# EAGLE design sx1509-breakout_mount_remap5 (EAGLE 9.1.3)
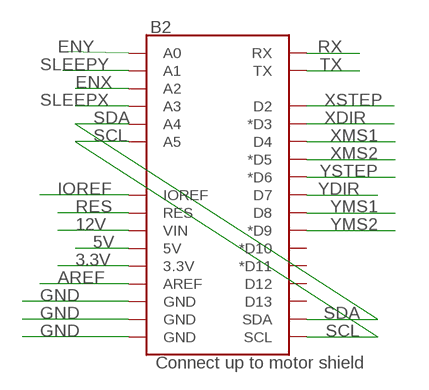
[diagram p0: schematic, sheet 1, part 1 of 2]
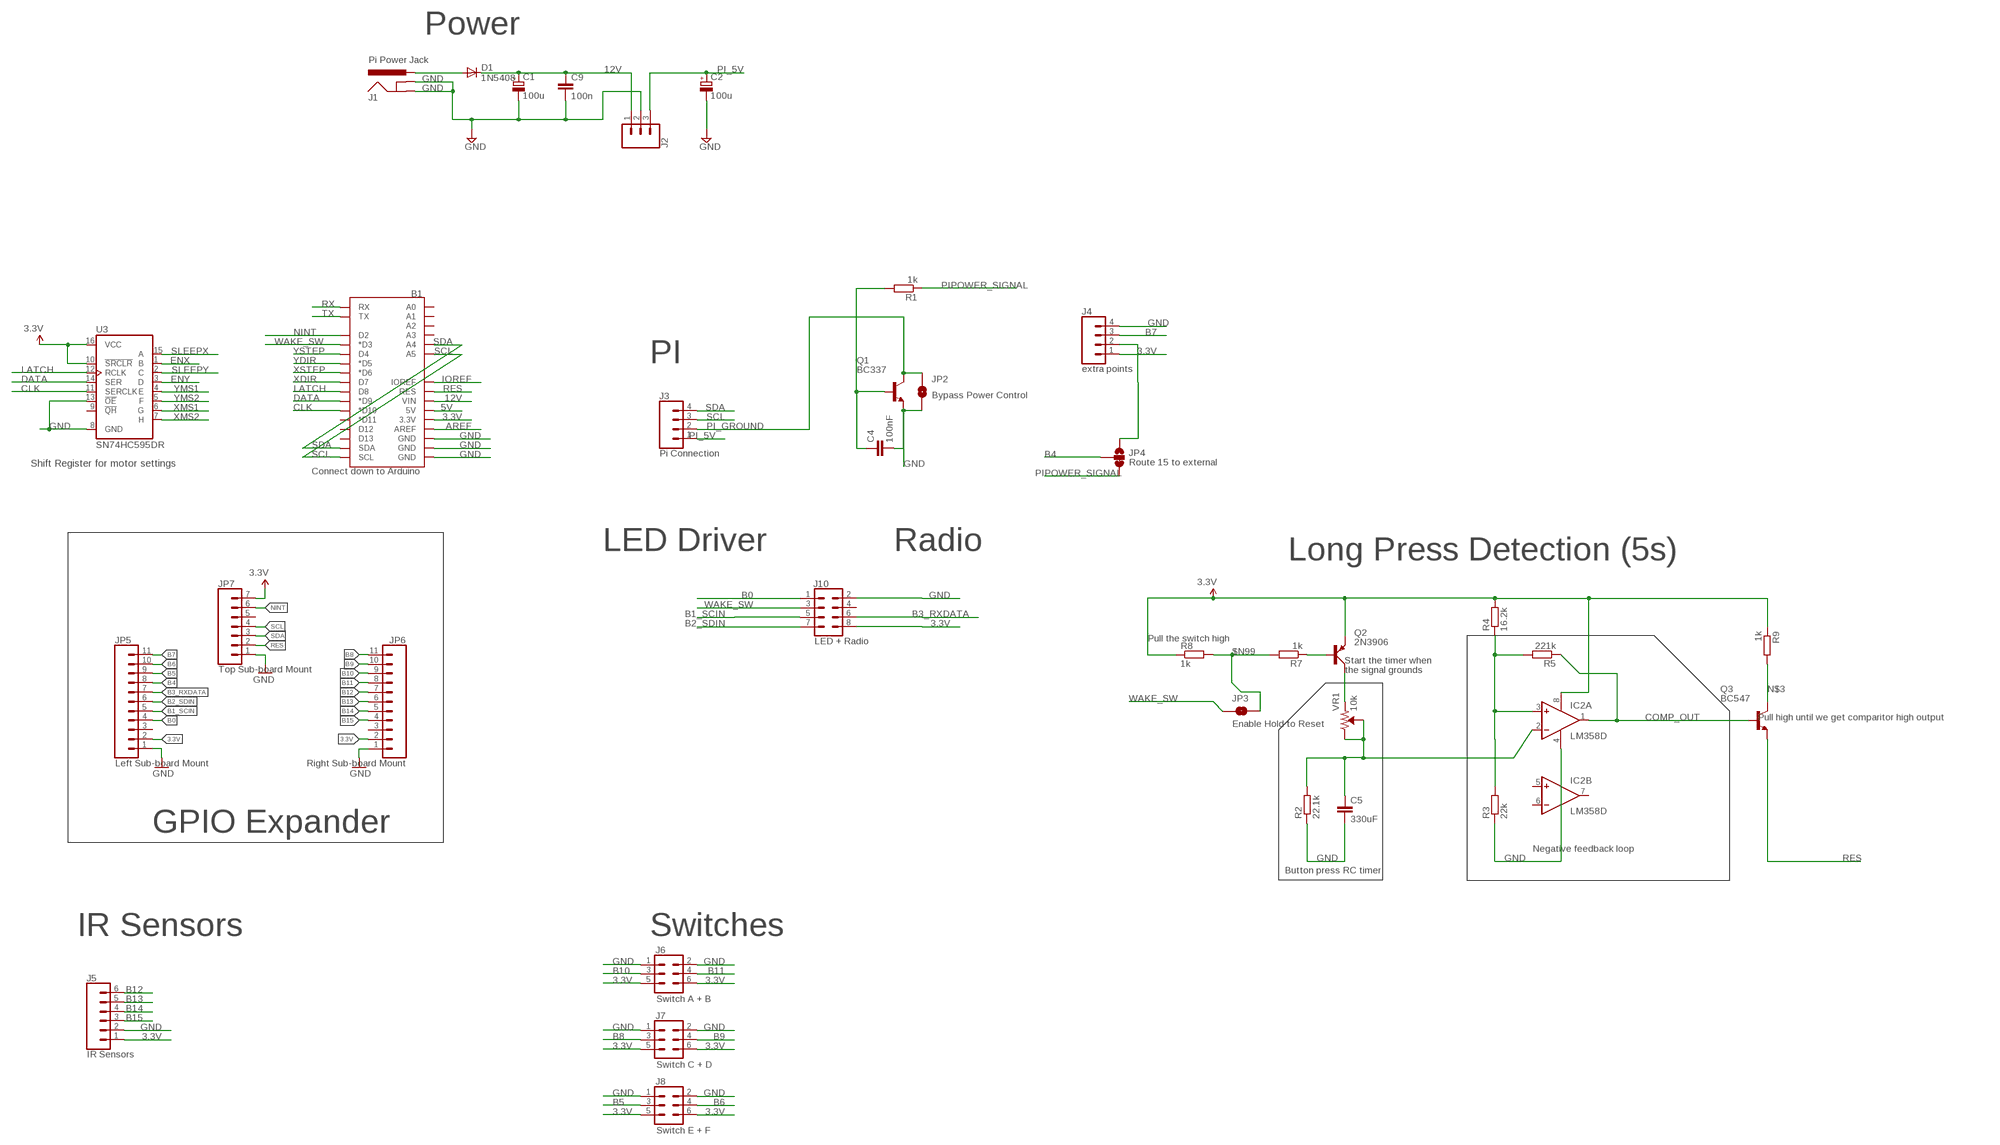
[diagram p1: schematic, sheet 1, part 2 of 2]

## Parts
B1  Connect down to Arduino  ARDUINO_UNO_R3_SHIELDNOLABELS  [UNO_R3_SHIELD_NOLABELS]
B2  Connect up to motor shield  ARDUINO_UNO_R3_SHIELDNOLABELS  [UNO_R3_SHIELD_NOLABELS]
C1  100u  CPOL-EUE2-5  [E2-5]
C2  100u  CPOL-EUE2-5  [E2-5]
C4  100nF  C-EUC0805  [C0805]
C5  330uF  C-EUC0805  [C0805]
C9  100n  C-EUC0805  [C0805]
D1  1N5408  [DO15-12]
IC2  LM358D  [SO08]
J1  Pi Power Jack  POWER_JACKPTH_BREAD  [POWER_JACK_PTH_BREAD]
J2  Header - Right angled, female  CONN_031X03_2.54MM_RA_FEMALE  [1X03]
J3  Pi Connection  CONN_041X04_1.24MM_RA_MALE  [1X04_1.24MM_RA_MALE]
J4  extra points  CONN_041X04_1.24MM_RA_MALE  [1X04_1.24MM_RA_MALE]
J5  IR Sensors  CONN_06SILK_FEMALE_PTH  [1X06]
J6  Switch A + B  CONN_03X22X03_2.54MM_RA_MALE  [2X3]
J7  Switch C + D  CONN_03X22X03_2.54MM_RA_MALE  [2X3]
J8  Switch E + F  CONN_03X22X03_2.54MM_RA_MALE  [2X3]
J10  LED + Radio  CONN_04X22X4_1.24MM_RA_MALE  [2X4]
JP2  Bypass Power Control  JUMPER-SMT_2_NO_SILK_ROUND  [SMT-JUMPER_2_NO_SILK_ROUND]
JP3  Enable Hold to Reset  JUMPER-SMT_2_NC_TRACE_SILK  [SMT-JUMPER_2_NC_TRACE_SILK]
JP4  Route 15 to external  JUMPER-SMT_3_1-NC_TRACE_SILK  [SMT-JUMPER_3_1-NC_TRACE_SILK]
JP5  Left Sub-board Mount  CONN_111X11_2.54MM_FEMALE  [1X11]
JP6  Right Sub-board Mount  CONN_111X11_2.54MM_FEMALE  [1X11]
JP7  Top Sub-board Mount  CONN_071X07_2.54MM_FEMALE  [1X07]
Q1  BC337  [TO92]
Q2  2N3906  [TO92D]
Q3  BC547  [TO92]
R1  1k  R-EU_M0805  [M0805]
R2  22.1k  R-EU_M0805  [M0805]
R3  22k  R-EU_M0805  [M0805]
R4  16.2k  R-EU_M0805  [M0805]
R5  221k  R-EU_M0805  [M0805]
R7  1k  R-EU_M0805  [M0805]
R8  1k  R-EU_M0805  [M0805]
R9  1k  R-EU_M0805  [M0805]
U3  SN74HC595DR  SN74HC595HCD  [SO16]
VR1  10k  TRIMPOT-PTH-10MM-KNOB-1/2W-10%  [TRIMPOT-PTH-3386U]

## Nets
3.3V: B1.3.3V B2.3.3V IC2.8(P:V+) J4.1 J5.1 J6.5 J6.6 J7.5 J7.6 J8.5 J8.6 J10.8 JP5.2 JP6.2 JP7.7 Q2.E R4.2 R8.1 R9.1 U3.10(!SRCLR) U3.16(VCC)
5V: B1.5V B2.5V
12V [12v]: B1.VIN B2.VIN C1.+ C9.1 D1.C J2.1
15_PLUG: J4.2 JP4.1
$N99: JP3.2 R7.2 R8.2
AREF: B1.AREF B2.AREF
B0: J10.1 JP5.4
B1_SCIN: J10.5 JP5.5
B2_SDIN: J10.7 JP5.6
B3_RXDATA: J10.6 JP5.7
B4: JP4.2 JP5.8
B5: J8.3 JP5.9
B6: J8.4 JP5.10
B7: J4.3 JP5.11
B8: J7.3 JP6.11
B9: J7.4 JP6.10
B10: J6.3 JP6.9
B11: J6.4 JP6.8
B12: J5.6 JP6.7
B13: J5.5 JP6.6
B14: J5.4 JP6.5
B15: J5.3 JP6.4
CLK: B1.D10(*D10) U3.11(SERCLK)
COMP_OUT: IC2.1(A:OUT) Q3.2(B) R5.1
DATA: B1.D9(*D9) U3.14(SER)
ENX: B2.A2 U3.1(B)
ENY: B2.A0 U3.3(D)
GND [5v]: B1.GND@0(GND) B1.GND@1(GND) B1.GND@2(GND) B2.GND@0(GND) B2.GND@1(GND) B2.GND@2(GND) C1.- C2.- C4.2 C5.2 C9.2 IC2.4(P:V-) J1.GND J1.GNDBREAK J2.2 J4.4 J5.2 J6.1 J6.2 J7.1 J7.2 J8.1 J8.2 J10.2 JP2.2 JP5.1 JP6.1 JP7.1 Q1.1(E) R2.1 R3.1 U3.8(GND) U3.13(!OE)
IOREF: B1.IOREF B2.IOREF
LATCH: B1.D8 U3.12(RCLK)
N$1: Q2.B R7.1
N$2: C4.1 Q1.2(B) R1.2
N$3: Q3.3(C) R9.2
N$4 [12v]: D1.A J1.PWR
N$5: IC2.3(A:+IN) R3.2 R4.1 R5.2
N$7: Q2.C VR1.1(CCW)
N$8: C5.1 IC2.2(A:-IN) R2.2 VR1.2(WIPER) VR1.3(CW)
NINT: B1.D2 JP7.6
PI_5V [5v]: C2.+ J2.3 J3.1
PI_GROUND [5v]: J3.2 JP2.1 Q1.3(C)
PIPOWER_SIGNAL: JP4.3 R1.1
RES: B1.RES B2.RES JP7.2 Q3.1(E)
RX: B1.RX B2.RX
SCL: B1.A5 B1.SCL B2.A5 B2.SCL J3.3 JP7.4
SDA: B1.A4 B1.SDA B2.A4 B2.SDA J3.4 JP7.3
SLEEPX: B2.A3 U3.15(A)
SLEEPY: B2.A1 U3.2(C)
TX: B1.TX B2.TX
WAKE_SW: B1.D3(*D3) J10.3 JP3.1
XDIR: B1.D7 B2.D3(*D3)
XMS1: B2.D4 U3.6(G)
XMS2: B2.D5(*D5) U3.7(H)
XSTEP: B1.D6(*D6) B2.D2
YDIR: B1.D5(*D5) B2.D7
YMS1: B2.D8 U3.4(E)
YMS2: B2.D9(*D9) U3.5(F)
YSTEP: B1.D4 B2.D6(*D6)
Unconnected: B1.A0 B1.A1 B1.A2 B1.A3 B1.D11(*D11) B1.D12 B1.D13 B2.D10(*D10) B2.D11(*D11) B2.D12 B2.D13 IC2.5(B:+IN) IC2.6(B:-IN) IC2.7(B:OUT) J10.4 JP5.3 JP6.3 JP7.5 U3.9(!QH)

## Notes on the sheet
- Power
- PI
- Shift Register for motor settings
- LED Driver | Radio | Long Press Detection (5s)
- Start the timer when
  the signal grounds
- GPIO Expander
- Negative feedback loop
- Button press RC timer
- IR Sensors | Switches

## Library data of the parts
B1 B2 = keir_library:ARDUINO_UNO_R3_SHIELD: Arduino R3 Shield Footprint Shield form compatible with the Arduino Uno R3. SparkFun Products: MG2639 Cellular Shield <https://www.sparkfun.com/products/13120> MIDI Shield <https://www.sparkfun.com/products/12898> R3 Stackable Headers Kit <https://www.sparkfun.com/products/11417>
C1 C2 = rcl:CPOL-EU: POLARIZED CAPACITOR, European symbol; SPICEPREFIX: C
C4 C5 = resistor:C-EU: CAPACITOR, European symbol
C9 = rcl:C-EU: CAPACITOR, European symbol; SPICEPREFIX: C
D1 = keir_library:1N5408: DIODE controlled avalanche rectifier
IC2 = keir_library:LM358: OP AMP also LM158; LM258; LM2904 Source: http://cache.national.com/ds/LM/LM158.pdf
J1 = SparkFun-Connectors:POWER_JACK: Power Jack Connector This is the standard 5.5mm barrel jack for power. The PTH is the most common, proven, reliable, footprint. The Slot footprint only works if the mill layer is transmitted to the PCB fab house so be warned. Here are the connectors we sell at SparkFun: DC Barrel Power Jack/Connector <https://www.sparkfun.com/products/119> (PRT-00119) DC Barrel Power Jack/Connector (SMD) <https://www.sparkfun.com/products/12748> (PRT-12748) DC Barrel Jack Adapter - Breadboard Compatible <https://www.sparkfun.com/products/10811> (PRT-10811) It is used on this SparkFun product (and many, many others): SparkFun RedBoard - Programmed with Arduino <https://www.sparkfun.com/products/12757> (DEV-12757) Also, if you need a mating power supply or connector, please check these out: Wall Adapter Power Supply - 9VDC 650mA <https://www.sparkfun.com/products/298> (TOL-00298) DC Barrel Jack Adapter - Male <https://www.sparkfun.com/products/10287> (PRT-10287); PROD_ID: PRT-10811
J2 = keir_library:CONN_03: Multi connection point. Often used as Generic Header-pin footprint for 0.1 inch spaced/style header connections On any of the 0.1 inch spaced packages, you can populate with these: Break Away Headers - Straight <https://www.sparkfun.com/products/116> (PRT-00116) Break Away Male Headers - Right Angle <https://www.sparkfun.com/products/553> (PRT-00553) Female Headers <https://www.sparkfun.com/products/115> (PRT-00115) Break Away Headers - Machine Pin <https://www.sparkfun.com/products/117> (PRT-00117) Break Away Female Headers - Swiss Machine Pin <https://www.sparkfun.com/products/743> (PRT-00743) Stackable Header - 3 Pin (Female, 0.1") <https://www.sparkfun.com/products/13875> (PRT-13875) For SCREWTERMINALS and SPRING TERMINALS visit here: Screw Terimnals on SparkFun.com <https://www.sparkfun.com/search/results?term=Screw+Terminals> (5mm/3.5mm/2.54mm spacing) This device is also useful as a general connection point to wire up your design to another part of your project. Our various solder wires solder well into these plated through hole pads. Hook-Up Wire - Assortment (Stranded, 22 AWG) <https://www.sparkfun.com/products/11375> (PRT-11375) Hook-Up Wire - Assortment (Solid Core, 22 AWG) <https://www.sparkfun.com/products/11367> (PRT-11367) View the entire wire category on our website here <https://www.sparkfun.com/categories/141> Special notes: Molex polarized connector foot print use with SKU : PRT-08232 with associated crimp pins and housings.
J3 J4 = keir_library:CONN_04: Multi connection point. Often used as Generic Header-pin footprint for 0.1 inch spaced/style header connections On any of the 0.1 inch spaced packages, you can populate with these: Break Away Headers - Straight <https://www.sparkfun.com/products/116> (PRT-00116) Break Away Male Headers - Right Angle <https://www.sparkfun.com/products/553> (PRT-00553) Female Headers <https://www.sparkfun.com/products/115> (PRT-00115) Break Away Headers - Machine Pin <https://www.sparkfun.com/products/117> (PRT-00117) Break Away Female Headers - Swiss Machine Pin <https://www.sparkfun.com/products/743> (PRT-00743) For SCREWTERMINALS and SPRING TERMINALS visit here: Screw Terimnals on SparkFun.com <https://www.sparkfun.com/search/results?term=Screw+Terminals> (5mm/3.5mm/2.54mm spacing) This device is also useful as a general connection point to wire up your design to another part of your project. Our various solder wires solder well into these plated through hole pads. Hook-Up Wire - Assortment (Stranded, 22 AWG) <https://www.sparkfun.com/products/11375> (PRT-11375) Hook-Up Wire - Assortment (Solid Core, 22 AWG) <https://www.sparkfun.com/products/11367> (PRT-11367) View the entire wire category on our website here <https://www.sparkfun.com/categories/141> Special notes: Molex polarized connector foot print use with SKU : PRT-08231 with associated crimp pins and housings. 1MM SMD Version SKU: PRT-10208
J5 = SparkFun-Connectors:CONN_06: Multi connection point. Often used as Generic Header-pin footprint for 0.1 inch spaced/style header connections On any of the 0.1 inch spaced packages, you can populate with these: Break Away Headers - Straight <https://www.sparkfun.com/products/116> (PRT-00116) Break Away Male Headers - Right Angle <https://www.sparkfun.com/products/553> (PRT-00553) Female Headers <https://www.sparkfun.com/products/115> (PRT-00115) Break Away Headers - Machine Pin <https://www.sparkfun.com/products/117> (PRT-00117) Break Away Female Headers - Swiss Machine Pin <https://www.sparkfun.com/products/743> (PRT-00743) Arduino Stackable Header - 6 Pin <https://www.sparkfun.com/products/9280> (PRT-09280) For SCREWTERMINALS and SPRING TERMINALS visit here: Screw Terimnals on SparkFun.com <https://www.sparkfun.com/search/results?term=Screw+Terminals> (5mm/3.5mm/2.54mm spacing) This device is also useful as a general connection point to wire up your design to another part of your project. Our various solder wires solder well into these plated through hole pads. Hook-Up Wire - Assortment (Stranded, 22 AWG) <https://www.sparkfun.com/products/11375> (PRT-11375) Hook-Up Wire - Assortment (Solid Core, 22 AWG) <https://www.sparkfun.com/products/11367> (PRT-11367) View the entire wire category on our website here <https://www.sparkfun.com/categories/141>; PROD_ID: CONN-08437
J6-J8 = keir_library:CONN_03X2: Multi connection point. Often used as Generic Header-pin footprint for 0.1 inch spaced/style header connections You can populate with any combo of single row headers, but if you'd like an exact match, check these: Header - 2x3 (Male, 0.1") <https://www.sparkfun.com/products/12807> (PRT-12807) Header - 2x3 (Female, 0.1") <https://www.sparkfun.com/products/13010> (PRT-13010) 2x3 Pin Shrouded Header <https://www.sparkfun.com/products/10877> (PRT-10877) On any of the 0.1 inch spaced packages, you can populate with these: Break Away Headers - Straight <https://www.sparkfun.com/products/116> (PRT-00116) Break Away Male Headers - Right Angle <https://www.sparkfun.com/products/553> (PRT-00553) Female Headers <https://www.sparkfun.com/products/115> (PRT-00115) Break Away Headers - Machine Pin <https://www.sparkfun.com/products/117> (PRT-00117) Break Away Female Headers - Swiss Machine Pin <https://www.sparkfun.com/products/743> (PRT-00743) Special note: the shrouded connector mates well with our 3x2 ribbon cables: Ribbon Crimp Connector - 6-pin (2x3, Female) <https://www.sparkfun.com/products/10651> (PRT-10651) Ribbon Cable - 6 wire (15ft) <https://www.sparkfun.com/products/10646> (PRT-10646)
J10 = keir_library:CONN_04X2: Multi connection point. Often used as Generic Header-pin footprint for 0.1 inch spaced/style header connections On any of the 0.1 inch spaced packages, you can populate with these: Break Away Headers - Straight <https://www.sparkfun.com/products/116> (PRT-00116) Break Away Male Headers - Right Angle <https://www.sparkfun.com/products/553> (PRT-00553) Female Headers <https://www.sparkfun.com/products/115> (PRT-00115) Break Away Headers - Machine Pin <https://www.sparkfun.com/products/117> (PRT-00117) Break Away Female Headers - Swiss Machine Pin <https://www.sparkfun.com/products/743> (PRT-00743)
JP2 = SparkFun-Jumpers:JUMPER-SMT_2_NO: Normally open jumper This jumper has two pads in close proximity to each other. Apply solder to close the connection. Round pads are easier to solder for beginners, but are a lot larger. SparkFun Product that uses the round pads: SparkFun EL Sequencer <https://www.sparkfun.com/products/12781>
JP3 = SparkFun-Jumpers:JUMPER-SMT_2_NC_TRACE: Normally closed trace jumper This jumper has a trace between two pads so it's normally closed (NC). Use a razor knife to open the connection. For best results follow the IPC guidelines for cutting traces: Cutout at least 0.063 mm (0.005 in). Remove all loose material to clean up the cut area. Seal the cut with an approved epoxy. Reapply solder to reclose the connection.
JP4 = SparkFun-Jumpers:JUMPER-SMT_3_1-NC_TRACE: Normally closed trace jumper (1 of 2 connections) This jumper has a trace between two pads so it's normally closed (NC). The other connection is normally open (NO). Use a razor knife to open the connection. For best results follow the IPC guidelines for cutting traces: Cutout at least 0.063 mm (0.005 in). Remove all loose material to clean up the cut area. Seal the cut with an approved epoxy. Reapply solder to reclose the connection, or to close the NO connection.
JP5 JP6 = keir_library:CONN_11: Multi connection point. Often used as Generic Header-pin footprint for 0.1 inch spaced/style header connections On any of the 0.1 inch spaced packages, you can populate with these: Break Away Headers - Straight <https://www.sparkfun.com/products/116> (PRT-00116) Break Away Male Headers - Right Angle <https://www.sparkfun.com/products/553> (PRT-00553) Female Headers <https://www.sparkfun.com/products/115> (PRT-00115) Break Away Headers - Machine Pin <https://www.sparkfun.com/products/117> (PRT-00117) Break Away Female Headers - Swiss Machine Pin <https://www.sparkfun.com/products/743> (PRT-00743) For SCREWTERMINALS and SPRING TERMINALS visit here: Screw Terimnals on SparkFun.com <https://www.sparkfun.com/search/results?term=Screw+Terminals> (5mm/3.5mm/2.54mm spacing) This device is also useful as a general connection point to wire up your design to another part of your project. Our various solder wires solder well into these plated through hole pads. Hook-Up Wire - Assortment (Stranded, 22 AWG) <https://www.sparkfun.com/products/11375> (PRT-11375) Hook-Up Wire - Assortment (Solid Core, 22 AWG) <https://www.sparkfun.com/products/11367> (PRT-11367) View the entire wire category on our website here <https://www.sparkfun.com/categories/141>
JP7 = keir_library:CONN_07: Multi connection point. Often used as Generic Header-pin footprint for 0.1 inch spaced/style header connections On any of the 0.1 inch spaced packages, you can populate with these: Break Away Headers - Straight <https://www.sparkfun.com/products/116> (PRT-00116) Break Away Male Headers - Right Angle <https://www.sparkfun.com/products/553> (PRT-00553) Female Headers <https://www.sparkfun.com/products/115> (PRT-00115) Break Away Headers - Machine Pin <https://www.sparkfun.com/products/117> (PRT-00117) Break Away Female Headers - Swiss Machine Pin <https://www.sparkfun.com/products/743> (PRT-00743) For SCREWTERMINALS and SPRING TERMINALS visit here: Screw Terimnals on SparkFun.com <https://www.sparkfun.com/search/results?term=Screw+Terminals> (5mm/3.5mm/2.54mm spacing) This device is also useful as a general connection point to wire up your design to another part of your project. Our various solder wires solder well into these plated through hole pads. Hook-Up Wire - Assortment (Stranded, 22 AWG) <https://www.sparkfun.com/products/11375> (PRT-11375) Hook-Up Wire - Assortment (Solid Core, 22 AWG) <https://www.sparkfun.com/products/11367> (PRT-11367) View the entire wire category on our website here <https://www.sparkfun.com/categories/141> Special notes: Molex polarized connector foot print use with SKU : PRT-08231 with associated crimp pins and housings. 1MM SMD Version SKU: PRT-10208 NOTES ON THE VARIANTS LOCK and LOCK_LONGPADS... This footprint was designed to help hold the alignment of a through-hole component (i.e. 6-pin header) while soldering it into place. You may notice that each hole has been shifted either up or down by 0.005 of an inch from it's more standard position (which is a perfectly straight line). This slight alteration caused the pins (the squares in the middle) to touch the edges of the holes. Because they are alternating, it causes a "brace" to hold the component in place. 0.005 has proven to be the perfect amount of "off-center" position when using our standard breakaway headers. Although looks a little odd when you look at the bare footprint, once you have a header in there, the alteration is very hard to notice. Also,if you push a header all the way into place, it is covered up entirely on the bottom side.
Q1 = transistor-npn:BC337*: NPN Transistor
Q2 = transistor-small-signal:2N3906: PNP TRANSISTOR
Q3 = transistor-npn:BC547*: NPN Transistor; NOTE: Pull high until we get comparitor high output
R1-R5 R7 R9 = rcl:R-EU_: RESISTOR, European symbol; SPICEPREFIX: R
R8 = rcl:R-EU_: RESISTOR, European symbol; NOTE: Pull the switch high; SPICEPREFIX: R
U3 = keir_library:SN74HC595: 8-Bit Shift Register (Serial to Parallel) Datasheet <http://www.ti.com/lit/ds/symlink/sn74hc595.pdf> SparkFun Products Shift-In parallel out - SN74HC595; PROD_ID: IC-11325; VALUE: SN74HC165DR
VR1 = SparkFun-Resistors:TRIMPOT: Trimming Potentiometer (Trimpot) Three-terminal potentiometers, with an adjustable wiper and two adjustable resistors. A pot can be used to create a configurable voltage divider, or as a variable resistor. "Trimpots" are a subset of potentiometers, usually intended for "set-and-forget" applications. They're often more delicate than standard potentiometers - rated for fewer turns. Variants PTH-KNOB - PTH Trimpot w/ finger-adjustable knob Trimpot 10K with Knob <https://www.sparkfun.com/products/9806> (COM-09806) Datasheet <http://www.sparkfun.com/datasheets/Components/General/TSR-3386.pdf> SMD-3MM-CLOSED-FRAME - SMD 3mm Square Closed-Frame Trimpot Used on e.g. EasyDriver - Stepper Motor Driver <https://www.sparkfun.com/products/12779> Datasheet <http://www.bitechnologies.com/pdfs/22.pdf> (22AR10KTR) SMD-5MM - SMD 5mm Square Closed-Frame Trimpot Used on e.g. IOIO-OTG - V2.2 <https://www.sparkfun.com/products/13613> Datasheet <http://www.vishay.com/docs/51008/ts53.pdf> (TS53YL502MR10) SMD-3MM-1/10W-25% - 3mm Square Open-Frame Trimpot Used on e.g. SparkFun Shapeoko <https://www.sparkfun.com/products/13899> Datasheet <http://www.bourns.com/docs/Product-Datasheets/TC33.pdf> (TC33X-2-103E); PROD_ID: RES-09730; SF_SKU: COM-09806

## Net classes
1 12v: width 1.6 mm, clearance 0.31 mm
2 5v: width 1.6 mm

## Board
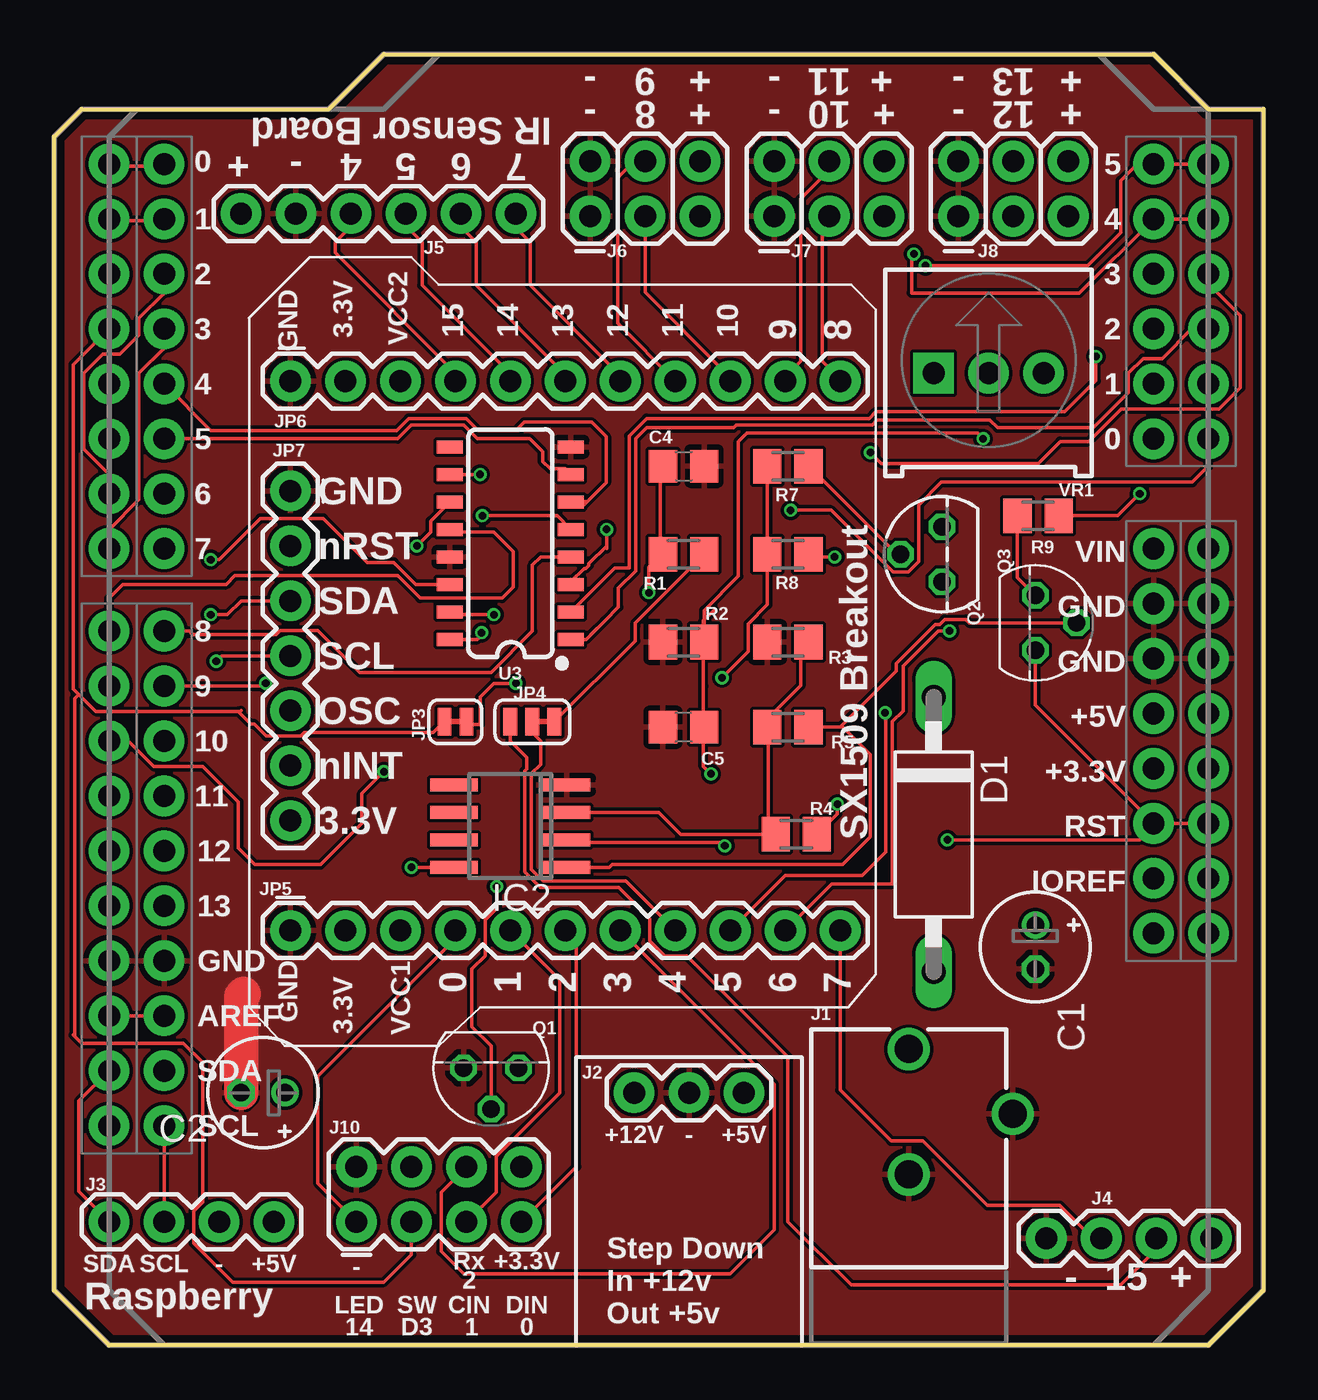
[diagram p2: board, top side]
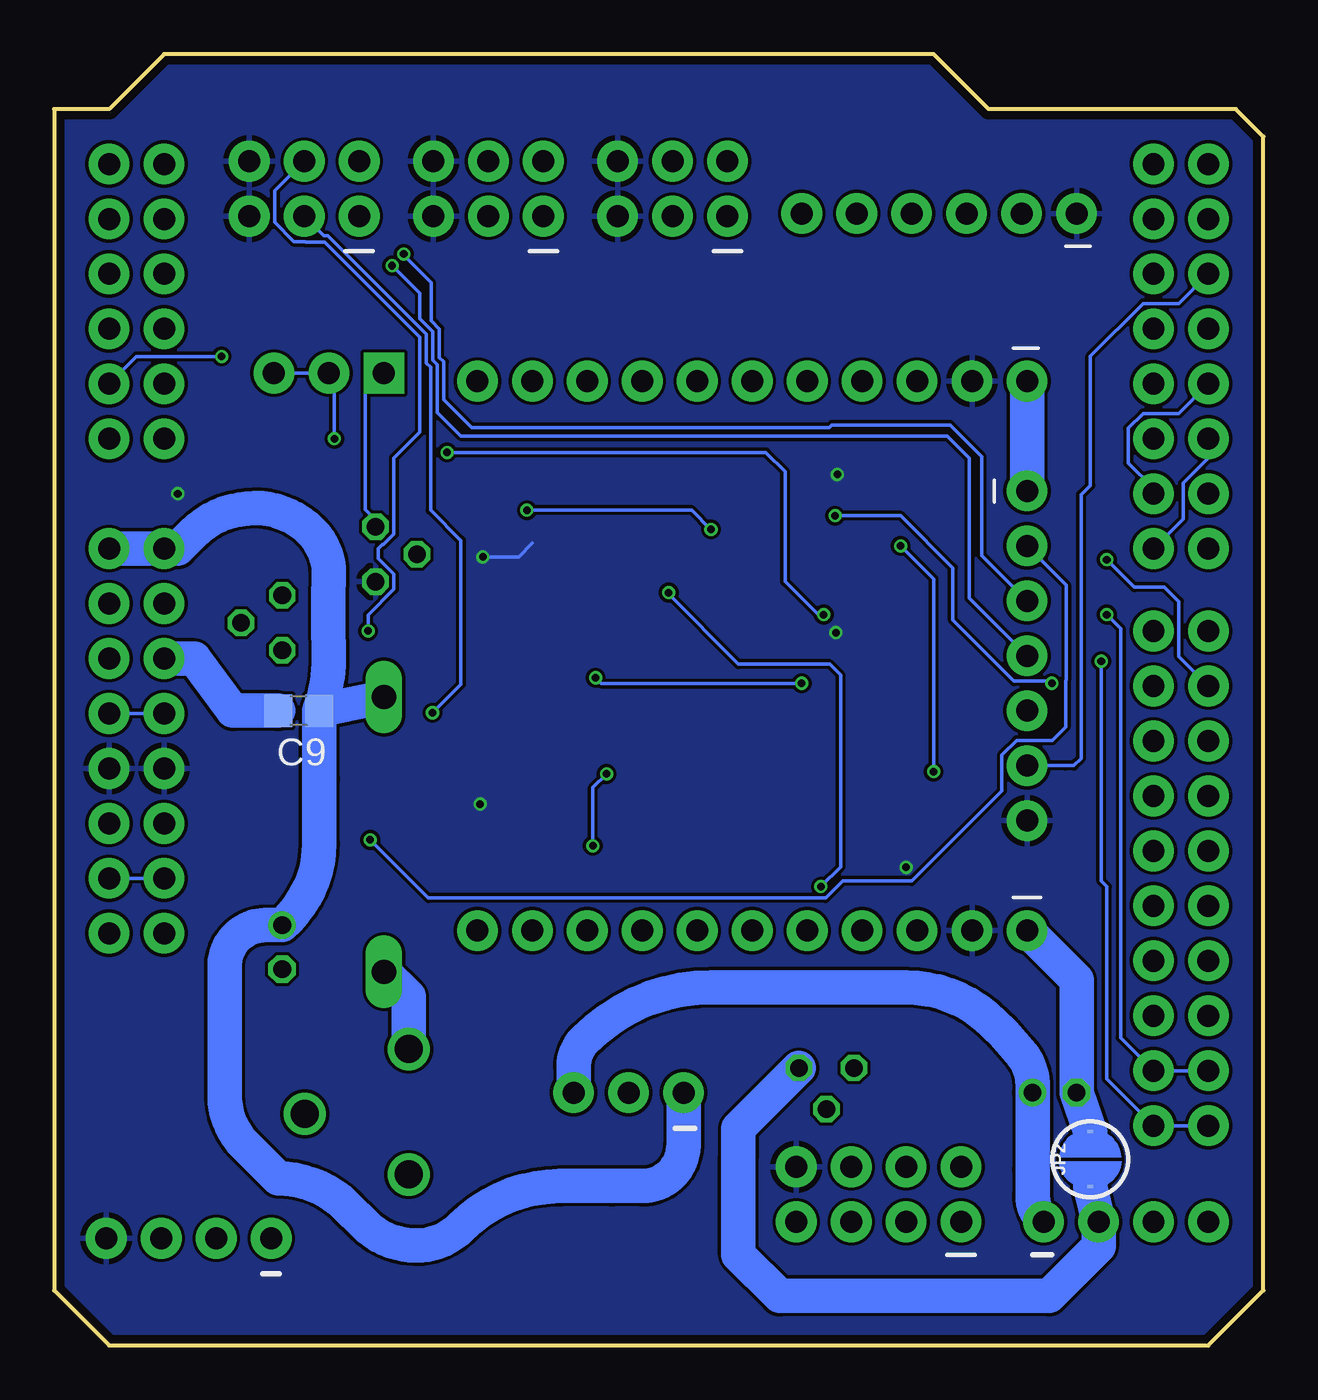
[diagram p3: board, bottom side, seen from below]

Size 55.88 x 59.69 mm. Coordinates in mm from the lower left corner, seen from the top.
Outline: 0,2.54 0,55.88 1.27,57.15 12.7,57.15 15.24,59.69 50.8,59.69 53.34,57.15 55.88,57.15 55.88,2.54 53.34,0 2.54,0 0,2.54
Copper layers (1*16): Top 0.035559375mm / dielectric 1.6mm / Bottom 0.035559375mm
Design rules "oshpark-2layer": minimum track width 6mil, minimum drill 10mil, track to track 6mil, track to pad 6mil, pad to pad 6mil, via to via 6mil, smd to smd 6mil, copper to edge 15mil, drill to drill 6mil, minimum pad ring 5mil, minimum via ring 5mil, stop-mask expansion 2.5mil, vias tented up to drill 0mil, thermal gap 10mil

### Footprints (pad centres in the part's own frame; a part is rotated, then mirrored left to right if it is on the bottom)
UNO_R3_SHIELD_NOLABELS = drill 1.016 pad 1.88: 3.3V 24.13,-3.81; 5V 24.13,-1.27; A0 24.13,11.43; A1 24.13,13.97; A2 24.13,16.51; A3 24.13,19.05; A4 24.13,21.59; A5 24.13,24.13; AREF -24.13,-15.24; D2 -24.13,19.05; D3 -24.13,16.51; D4 -24.13,13.97; D5 -24.13,11.43; D6 -24.13,8.89; D7 -24.13,6.35; D8 -24.13,2.54; D9 -24.13,0; D10 -24.13,-2.54; D11 -24.13,-5.08; D12 -24.13,-7.62; D13 -24.13,-10.16; GND@0 24.13,1.27; GND@1 24.13,3.81; GND@2 -24.13,-12.7; IOREF 24.13,-8.89; NC 24.13,-11.43; RES 24.13,-6.35; RX -24.13,24.13; SCL -24.13,-20.32; SDA -24.13,-17.78; TX -24.13,21.59; VIN 24.13,6.35
E2-5 = drill 0.813 pad 1.27: + -1.016,0 | drill 0.813 pad 1.27 octagon: - 1.016,0
C0805 = smd 1.3 x 1.5: 1 -0.95,0; 2 0.95,0
DO15-12 = drill 1.118 long: A 6.35,0; C -6.35,0
SO08 = smd 0.6 x 2.2: 1 -1.905,-2.6; 2 -0.635,-2.6; 3 0.635,-2.6; 4 1.905,-2.6; 5 1.905,2.6; 6 0.635,2.6; 7 -0.635,2.6; 8 -1.905,2.6
POWER_JACK_PTH_BREAD = drill 1.3: GND 0,7.9; GNDBREAK 4.8,10.7; PWR 0,13.7
1X03 = drill 1.016 pad 1.88: 1 0,0; 2 2.54,0; 3 5.08,0
1X04_1.24MM_RA_MALE = drill 1.016 pad 1.88: 1 0,0; 2 2.54,0; 3 5.08,0; 4 7.62,0
1X06 = drill 1.016 pad 1.88: 1 0,0; 2 2.54,0; 3 5.08,0; 4 7.62,0; 5 10.16,0; 6 12.7,0
2X3 = drill 1.016 pad 1.88: 1 0,0; 2 0,2.54; 3 2.54,0; 4 2.54,2.54; 5 5.08,0; 6 5.08,2.54
2X4 = drill 1.016 pad 1.88: 1 -3.81,-1.27; 2 -3.81,1.27; 3 -1.27,-1.27; 4 -1.27,1.27; 5 1.27,-1.27; 6 1.27,1.27; 7 3.81,-1.27; 8 3.81,1.27
SMT-JUMPER_2_NO_SILK_ROUND = smd 0.152 x 0.305: 1 -1.27,0; 2 1.27,0
SMT-JUMPER_2_NC_TRACE_SILK = smd 0.635 x 1.27: 1 -0.508,0; 2 0.508,0
SMT-JUMPER_3_1-NC_TRACE_SILK = smd 0.635 x 1.27: 1 -1.016,0; 2 0,0; 3 1.016,0
1X11 = drill 1.016 pad 1.88: 1 0,0; 2 2.54,0; 3 5.08,0; 4 7.62,0; 5 10.16,0; 6 12.7,0; 7 15.24,0; 8 17.78,0; 9 20.32,0; 10 22.86,0; 11 25.4,0
1X07 = drill 1.016 pad 1.88: 1 0,0; 2 2.54,0; 3 5.08,0; 4 7.62,0; 5 10.16,0; 6 12.7,0; 7 15.24,0
TO92 = drill 0.813 octagon: 1 1.27,0; 2 0,1.905; 3 -1.27,0
TO92D = drill 0.813 octagon: B 0,1.905; C 1.27,0; E -1.27,0
M0805 = smd 1.3 x 1.6: 1 -0.95,0; 2 0.95,0
SO16 = smd 0.6 x 1.2: 1 -4.445,-2.8; 2 -3.175,-2.8; 3 -1.905,-2.8; 4 -0.635,-2.8; 5 0.635,-2.8; 6 1.905,-2.8; 7 3.175,-2.8; 8 4.445,-2.8; 9 4.445,2.8; 10 3.175,2.8; 11 1.905,2.8; 12 0.635,2.8; 13 -0.635,2.8; 14 -1.905,2.8; 15 -3.175,2.8; 16 -4.445,2.8
TRIMPOT-PTH-3386U = drill 1.016 pad 1.88 square: 1 -2.54,-0.015 | drill 1.016 pad 1.88: 2 0,-0.015; 3 2.54,-0.015

### Placement (x,y rotation side)
B1  26.67,30.48 0 top
B2  29.21,30.48 0 top
C1  45.34,18.41 270 top
C2  9.65,11.68 180 top
C4  29.08,40.64 0 top
C5  29.08,28.57 180 top
C9  44.58,29.34 180 bottom
D1  40.64,23.62 270 top
IC2  21.08,24 90 top
J1  39.5,0 0 top
J2  26.8,11.68 0 top
J3  10.16,5.71 180 top
J4  53.47,4.95 180 top
J5  8.64,52.32 0 top
J6  24.77,52.2 0 top
J7  33.27,52.2 0 top
J8  41.78,52.2 0 top
J10  17.78,6.99 0 top
JP2  8,8.61 90 bottom
JP3  18.54,28.83 0 top
JP4  22.1,28.83 0 top
JP5  10.92,19.18 0 top
JP6  10.92,44.58 0 top
JP7  10.92,39.5 270 top
Q1  20.19,12.83 180 top
Q2  41.02,36.58 90 top
Q3  45.34,33.4 270 top
R1  29.08,36.58 180 top
R2  29.08,32.51 0 top
R3  33.91,32.51 0 top
R4  34.29,23.62 0 top
R5  33.91,28.57 180 top
R7  33.91,40.64 180 top
R8  33.91,36.58 180 top
R9  45.47,38.35 180 top
U3  21.08,37.08 90 top
U$2  [TRI_LOGO_TOP_15MM]  103.76,3.43 180 top  (outside the outline)
VR1  43.18,44.96 0 top

### Tracks (layer width: path | path; a pad name or v marks a point on that pad's centre or on a via)
3.3V  (via drill 0.35)
  Top 0.152: R8.1 34.99,36.45 v36.07,36.45 | IC2.8 v16.51,22.1 | R9.1 49.15,38.35 v50.16,39.37 | v36.2,25.02 36.2,24.58 R4.2 | U3.10 v19.68,40.26 | U3.16 19.56,32.64 19.75,32.84 v19.75,32.95
  Bottom 0.152: v36.07,36.45 34.42,36.45 33.78,37.08
  pour Bottom: 0,55.88 1.27,57.15 12.7,57.15 15.24,59.69 50.8,59.69 53.34,57.15 55.88,57.15 55.88,2.54 53.34,0 2.54,0 0,2.54
5V
  Bottom 0.152: B1.5V B2.5V
12V
  Bottom 1.6: B2.VIN B1.VIN 50.16,36.83 49.47,37.52 arc45 46.61,38.71 arc45 43.99,37.62 arc45 43.18,35.67 | 26.8,9.27 J2.1 26.8,9.27 | 26.8,9.27 arc90 28.7,7.37 30.1,7.37 32.51,7.37 arc-45 37.06,5.48 arc45 39.15,4.62 arc45 41.55,5.61 42.35,6.41 arc-45 45.53,7.72 47.03,9.23 arc45 48.01,11.58 48.01,17.53 arc90 46.1,19.43 C1.+ 45.07,19.7 arc-45 43.63,23.18 43.63,26.16 C9.1 | 43.18,35.67 | 43.18,35.67 arc-4 43.18,32 arc23 C9.1 | C9.1 D1.C
15_PLUG
  Top 0.152: 21,28.5 JP4.1 21.08,27.94 21.84,27.18 21.84,26.66 21.74,26.55 21.74,21.88 22.47,21.16 26.09,21.16 27.53,19.71 27.53,18.69 28.22,18.01 29.23,18.01 33.91,13.34 33.91,5.71 36.83,2.79 49.28,2.79 50.93,4.45 J4.2
$N99  (via drill 0.35)
  Top 0.152: R7.2 R8.2 32.96,34.23 32.08,33.36 32.08,32.08 v30.86,30.86 | JP3.2 19.18,28.7 19.68,28.7 19.68,29.97 20.32,30.61 v21.34,30.61
  Bottom 0.152: v21.34,30.61 30.61,30.61 v30.86,30.86
AREF
  Top 0.152: B2.AREF B1.AREF
B0
  Top 0.152: J10.1 12.19,7.49 12.19,10.41 12.19,12.45 18.54,18.8 JP5.4
B1_SCIN
  Top 0.152: J10.5 20.42,7.09 20.42,8.74 23.37,11.69 23.37,16.89 JP5.5
B2_SDIN
  Top 0.152: JP5.6 24.13,18.67 24.13,8.26 J10.7
B3_RXDATA
  Top 0.152: J10.6 17.88,7.09 17.88,4.34 18.92,3.3 31.24,3.3 33.27,5.33 33.27,12.06 JP5.7
B4
  Top 0.152: JP5.8 26.42,21.46 22.59,21.46 22.05,22.01 22.05,26.43 22.48,26.86 22.48,27.94 22.23,28.2 | 22.1,28.33 22.23,28.2 | JP4.2 22.1,28.33 | 22.1,28.33 22.23,28.2
B5  (via drill 0.35)
  Top 0.152: JP5.9 33.78,21.72 37.34,21.72 38.43,22.81 38.43,29.21 v38.4,29.25
  Bottom 0.152: J8.3 43.42,51.3 43.24,51.3 38.68,46.73 38.68,45.41 38.48,45.21 38.48,38.61 37.08,37.21 37.08,30.56 v38.4,29.25
B6  (via drill 0.35)
  Top 0.152: JP5.10 35.94,21.34 38.73,21.34 38.73,28.84 39.23,29.32 39.23,31.11 39.23,31.4 40.85,33.02 41.4,33.02 v41.38,33.02 v41.37,33.02
  Bottom 0.152: J8.4 45.7,53.37 45.7,51.92 44.81,51.03 44.3,51.03 44.26,50.99 43.37,50.99 38.99,46.61 38.99,42.22 40.18,41.02 40.18,37.59 40.18,37.5 40.67,37.01 40.72,37.01 40.89,36.83 40.89,36.36 40.18,35.65 40.18,35.43 40.18,34.96 41.37,33.77 v41.37,33.02
B7
  Top 0.152: JP5.11 36.32,11.81 38.68,9.45 40.14,9.45 43.12,6.47 46.48,6.47 47.99,4.95 J4.3
  Bottom 0.152: JP5.11 36.5,19
B8
  Top 0.152: JP6.11 36,45 35.5,45.5 35.5,52 J7.3
B9
  Top 0.152: JP6.10 34,45 34.5,45.5 34.5,53 35.5,54 35.5,54.5 J7.4
B10
  Top 0.152: JP6.9 31,45 27.3,48.7 J6.3
B11
  Top 0.152: JP6.8 26.04,47.24 26.04,53.98 26.8,54.74 J6.4
B12
  Top 0.152: JP6.7 26,45 22,49 22,51 21.5,51.5 21.5,52 J5.6
B13
  Top 0.152: JP6.6 23.5,45 19.5,49 19.5,51 19,51.5 19,52 J5.5
B14
  Top 0.152: JP6.5 21,45 17,49 17,51 16.5,51.5 16.5,52 J5.4
B15
  Top 0.152: JP6.4 18.5,45 13,50.5 13,51 13.5,51.5 13.5,52 J5.3
CLK  (via drill 0.35)
  Top 0.152: B1.D10 3.43,27.94 4.6,26.77 6.86,26.77 8.51,25.12 8.51,22.99 9.27,22.23 12.32,22.23 14.22,24.13 14.22,25.5 v15.24,26.52 | U3.11 17.4,38.11 17.4,37.97 17.4,37.59 v16.76,36.96
  Bottom 0.152: v15.24,26.52 15.24,30.48 15.24,35.43 v16.76,36.96 | v16.76,36.96 16.89,37.08 v16.76,36.96
COMP_OUT
  Top 0.152: 36.32,28.57 36.45,28.57 37.72,27.3 37.72,23.5 36.45,22.23 25.78,22.23 25.72,22.16 | 36.32,28.57 R5.1 | 36.32,28.57 38.92,31.17 38.92,31.52 40.72,33.33 40.92,33.33 41.15,33.55 42.12,33.55 42.28,33.4 Q3.2 | 25.65,22.1 25.72,22.16 | IC2.1 25.65,22.1 | 25.65,22.1 25.72,22.16
DATA  (via drill 0.35)
  Top 0.152: U3.14 16.71,35.18 15.7,36.19 14.48,36.19 12.45,38.23 9.53,38.23 7.62,36.32 v7.24,36.32
  Bottom 0.152: B1.D9 3.91,31.85 3.91,34.39 4.57,35.05 5.97,35.05 v7.24,36.32
ENX
  Top 0.152: B2.A2 52.58,46.99 51.21,45.62 50.32,45.62 49.63,44.93 49.63,44.04 48.01,42.42 43.6,42.42 43.24,42.77 38.02,42.77 37.79,42.54 31.52,42.54 31.4,42.42 27.38,42.42 26.87,41.91 26.87,35.8 26.07,35 26.07,34.12 25.44,33.49 | 24.8,32.85 25.44,33.49 | U3.1 24.59,32.64 25.44,33.49
ENY  (via drill 0.35)
  Top 0.152: v34.04,38.61 35.9,38.61 38.77,35.74 39.46,35.74 39.95,36.23 39.95,38.85 41,39.9 49.94,39.9 49.95,39.9 52.6,39.9 53.34,40.64 B2.A0 | 25.53,36.82 25.53,36.96 | 25.53,36.96 v25.53,37.72 | U3.3 23.88,35.31 24.49,35.92 24.58,35.92 24.71,36.05 24.71,36.14 25.53,36.96
  Bottom 0.152: v25.53,37.72 26.42,38.61 v34.04,38.61
GND
  Top 1.6: C2.- 8.64,16.13 8.76,16.26
  Bottom 1.6: JP2.2 C2.- 8.64,16.89 JP5.1 | B1.GND@0 49.4,31.75 47.62,29.34 C9.2 | JP7.1 JP6.1
  pour Top: 0,55.88 1.27,57.15 12.7,57.15 15.24,59.69 50.8,59.69 53.34,57.15 55.88,57.15 55.88,2.54 53.34,0 2.54,0 0,2.54
IOREF
  Bottom 0.152: B1.IOREF B2.IOREF
LATCH
  Top 0.152: U3.12 18.41,37.59 20.32,37.59 21.21,36.7 21.21,35.05 20.7,34.54 16.92,34.54 15.88,35.59 8.51,35.59 8.36,35.59 7.95,35.18 3.17,35.18 2.54,34.54 B1.D8
N$1
  Top 0.152: R7.1 35,40.5 39,36.5 Q2.B
N$2  (via drill 0.35)
  Top 0.152: C4.1 28,40.5 28,37 R1.2 28,36.5 27.48,35.98 v27.48,34.8 | Q1.2 20.19,13.84 19.3,14.73 19.3,17.4 19.91,18.01 19.91,19.66 20.45,20.19 v20.45,21.21
  Bottom 0.152: v20.45,21.21 19.54,22.12 19.54,30.99 20.04,31.5 24.26,31.5 27.56,34.8 v27.48,34.8
N$3
  Top 0.152: R9.2 44.5,38 44.5,35.51 Q3.3
N$4
  Bottom 1.6: J1.PWR 39.5,16.13 D1.A
N$5
  Top 0.152: R3.2 34.5,32.5 34.5,30.5 33,29 R5.2 33,28.5 33,24 R4.1 28.96,23.62 27.94,24.64 IC2.3
N$7
  Bottom 0.152: Q2.C 41.02,38.16 41.5,38.64 41.5,44.08 VR1.1
N$8  (via drill 0.35)
  Top 0.152: R2.2 30,32.5 30,30.48 30,29 C5.1 30,28.5 30,26.77 v30.35,26.42 | 30.5,34 30,33.5 30,33 R2.2 | R2.2 30.03,33.97 31.62,35.56 31.62,41.78 32,42.16 42.67,42.16 v42.93,41.91 | IC2.2 23.81,23.24 30.99,23.24 v30.99,23.09
  Bottom 0.152: v42.93,41.91 42.93,44.69 VR1.2 VR1.3 | v30.99,23.09 30.99,25.78 v30.35,26.42
NINT
  Bottom 0.152: JP7.6 9.14,26.8 8.76,26.8 8.42,27.14 8.42,39.33 8,39.75 8,45.72 5.56,48.16 3.91,48.16 B1.D2
PI_5V
  Bottom 1.6: J2.3 31.88,12.88 arc45 31.36,14.12 arc45 25.5,16.55 16.52,16.55 arc45 12.46,14.87 12,14.41 11.27,13.6 arc49 C2.+ 10.67,8.13 10.67,6.94 arc-45 J3.1
PI_GROUND
  Bottom 1.6: Q1.3 24.26,10.03 24.26,8.76 24.26,4.19 22.35,2.29 9.91,2.29 9.4,2.79 7.62,4.57 J3.2 JP2.1
PIPOWER_SIGNAL
  Top 0.152: R1.1 26.86,33.4 26.86,33.27 26.86,32.57 JP4.3
RES  (via drill 0.35)
  Top 0.152: Q3.1 45.34,29.59 B1.RES 50.93,24.13 | 50.93,24.13 B2.RES | v41.27,23.37 50.16,23.37 50.93,24.13
  Bottom 0.152: JP7.2 9.12,35.16 9.12,30.77 9.14,30.75 9.14,28.57 9.75,27.96 11.41,27.96 12.09,27.28 12.09,25.63 16.26,21.46 19.44,21.46 20.23,20.68 38.59,20.68 v41.27,23.37
RX
  Top 0.152: B1.RX 3,54.5 5,54.5 B2.RX
SCL  (via drill 0.35)
  Top 0.152: v7.49,31.62 7.75,31.88 JP7.4 | J3.3 B2.SCL | v40.26,49.91 47.75,49.91 49.28,51.44 49.28,53.85 50.04,54.61 B1.A5 B2.A5
  Bottom 0.152: v7.49,31.62 7.49,21.46 7.24,21.21 7.24,12.32 B2.SCL B1.SCL | v40.26,49.91 38.99,48.64 38.99,47.47 38.38,46.86 38.38,45.54 38.18,45.34 38.18,43.13 37.08,42.04 14.61,42.04 13.59,41.02 13.59,34.54 JP7.4
SDA  (via drill 0.35)
  Top 0.152: JP7.3 8.64,34.42 8,33.78 v7.24,33.78 | B1.SDA 1.14,11.3 1.14,7.11 J3.4 | v39.72,50.45 39.62,50.35 39.62,48.64 47.37,48.64 B1.A4 B2.A4
  Bottom 0.152: v39.72,50.45 39.75,50.42 38.46,49.12 38.46,47.37 38.08,46.99 38.08,45.67 37.87,45.47 37.87,43.71 36.58,42.42 20.07,42.42 19.94,42.55 14.48,42.55 13.02,41.08 13.02,36.51 JP7.3 | v7.24,33.78 6.6,33.15 6.6,14.22 B2.SDA B1.SDA
SLEEPX  (via drill 0.35)
  Top 0.152: B2.A3 53.34,49.07 54.81,47.6 54.81,44.27 53.82,43.28 49.3,43.28 47.8,41.78 46.48,41.78 45.47,40.77 38.23,40.77 v37.72,41.27 | U3.15 18.41,33.78 v20.32,33.78
  Bottom 0.152: v20.32,33.78 20.57,33.78 22.1,35.31 22.1,40.39 22.99,41.27 v37.72,41.27
SLEEPY  (via drill 0.35)
  Top 0.152: U3.2 25.91,35.94 26.57,35.94 26.57,42.04 27.38,42.85 37.67,42.85 37.97,43.16 46.71,43.16 48.14,44.59 v48.14,45.71
  Bottom 0.152: v48.14,45.71 52.08,45.71 B2.A1
TX
  Top 0.152: B1.TX 3,52 5,52 B2.TX
WAKE_SW
  Top 0.152: B1.D3 0.89,45.34 0.89,30.35 1.14,30.1 | 8.64,29.34 8.61,29.31 8.51,29.31 | 17.53,28.32 JP3.1 17.53,28.32 | J10.3 16.51,4.19 15.24,2.92 8.26,2.92 6.45,4.72 6.45,6.2 6.86,6.61 6.86,13.08 5.97,13.97 1.27,13.97 0.95,14.29 | 0.89,14.35 0.95,14.29 | 1.14,30.1 1.93,29.31 8.51,29.31 | 8.51,29.31 9.1,28.73 9.24,28.73 9.79,28.17 11.41,28.17 11.56,28.32 17.53,28.32 | 0.95,14.29 0.95,29.91 1.14,30.1
  Bottom 0.152: 2,46.5 2.5,46.5 B1.D3
XDIR
  Top 0.152: B2.D3 5.08,46.1 3.91,44.93 3.91,39.09 2.54,37.72 B1.D7
XMS1
  Top 0.152: B2.D4 7.24,42.29 13.34,42.29 | 13.34,42.29 13.59,42.29 | 21.34,42.29 21.46,42.29 | 24.63,39 25.5,39.88 25.5,42 24.84,42.67 21.72,42.67 21.34,42.29 | 24.63,39 24.49,38.86 | 21.34,42.29 19.61,42.29 19.05,42.85 16.38,42.85 15.82,42.29 13.34,42.29 | 15.32,42.29 13.34,42.29 | 24.63,39 23.89,39 U3.6
XMS2
  Top 0.152: 23.36,40.53 23.11,40.53 | 23.11,40.53 22.92,40.53 22.58,40.86 22.58,41.31 21.98,41.91 19.56,41.91 18.92,42.55 16.51,42.55 15.87,41.91 B2.D5 | 23.11,40.53 23.61,40.53 U3.7
XSTEP
  Top 0.152: B2.D2 5.08,48.64 3.91,47.47 3.91,46.71 3.02,45.82 2.26,45.82 1.37,44.93 1.37,41.43 2.54,40.26 B1.D6
YDIR
  Bottom 0.152: B1.D5 2.54,41.02 3.71,39.85 3.71,38.2 B2.D7
YMS1
  Top 0.152: B2.D8 6.24,33.02 6.38,32.87 10.26,32.87 10.44,33.05 12.19,33.05 14.12,31.11 20.19,31.11 22.1,33.02 22.1,36.07 22.48,36.45 U3.4
YMS2  (via drill 0.35)
  Top 0.152: B2.D9 7.62,30.48 9.65,30.48 v9.78,30.61 | U3.5 23.25,38.35 v19.79,38.35
  Bottom 0.152: v19.79,38.35 16.76,38.35 14.35,35.94 14.35,33.53 11.53,30.71 9.88,30.71 v9.78,30.61 | v19.79,38.35 19.81,38.35 v19.79,38.35
YSTEP
  Bottom 0.152: B1.D4 3.91,43.08 5.56,43.08 6.25,42.39 6.25,40.79 5.08,39.62 B2.D6

### Text on the board
tNames: - | 9 | + | - | 11 | + | - | 13 | + | IR Sensor Board | - | 8 | + | - | 10 | + | - | 12 | + | 0 | + | - | 4 | 5 | 6 | 7 | 5 | 1 | 4 | VCC2 | 2 | GND | 3.3V | 3 | 15 | 14 | 13 | 12 | 11 | 10 | 9 | 8 | 3 | 2 | 4 | 1 | 5 | 0 | 6 | GND | nRST | 7 | VIN | SDA | GND | 8 | SCL | GND | 9 | OSC | +5V | Rst hold time | 10 | nINT | +3.3V | 11 | 3.3V | SX1509 Breakout | RST | 12 | IOREF | 13 | GND | 0 | 1 | 2 | 3 | 4 | 5 | 6 | 7 | AREF | GND | 3.3V | VCC1 | SDA | SCL | +12V | - | +5V | SDA | SCL | - | +5V | - | Rx | +3.3V | - | 15 | + | 2 | Raspberry | LED | SW | CIN | DIN | 14 | D3 | 1 | 0 | Step Down / In +12v / Out +5v | Version 1.0.3 / By Keir Rice
bNames: Enable JP3 for / hard reset by switch. | Pi power control. / / Connect 1-3 & 2-4 / for soft switch via pin 15. / / Connect 3-5 & 4-6 / for always on. / Pin 15 routed to J4 connector.